# EAGLE schematic SensorNodeWithDisplay (EAGLE 9.6.2)
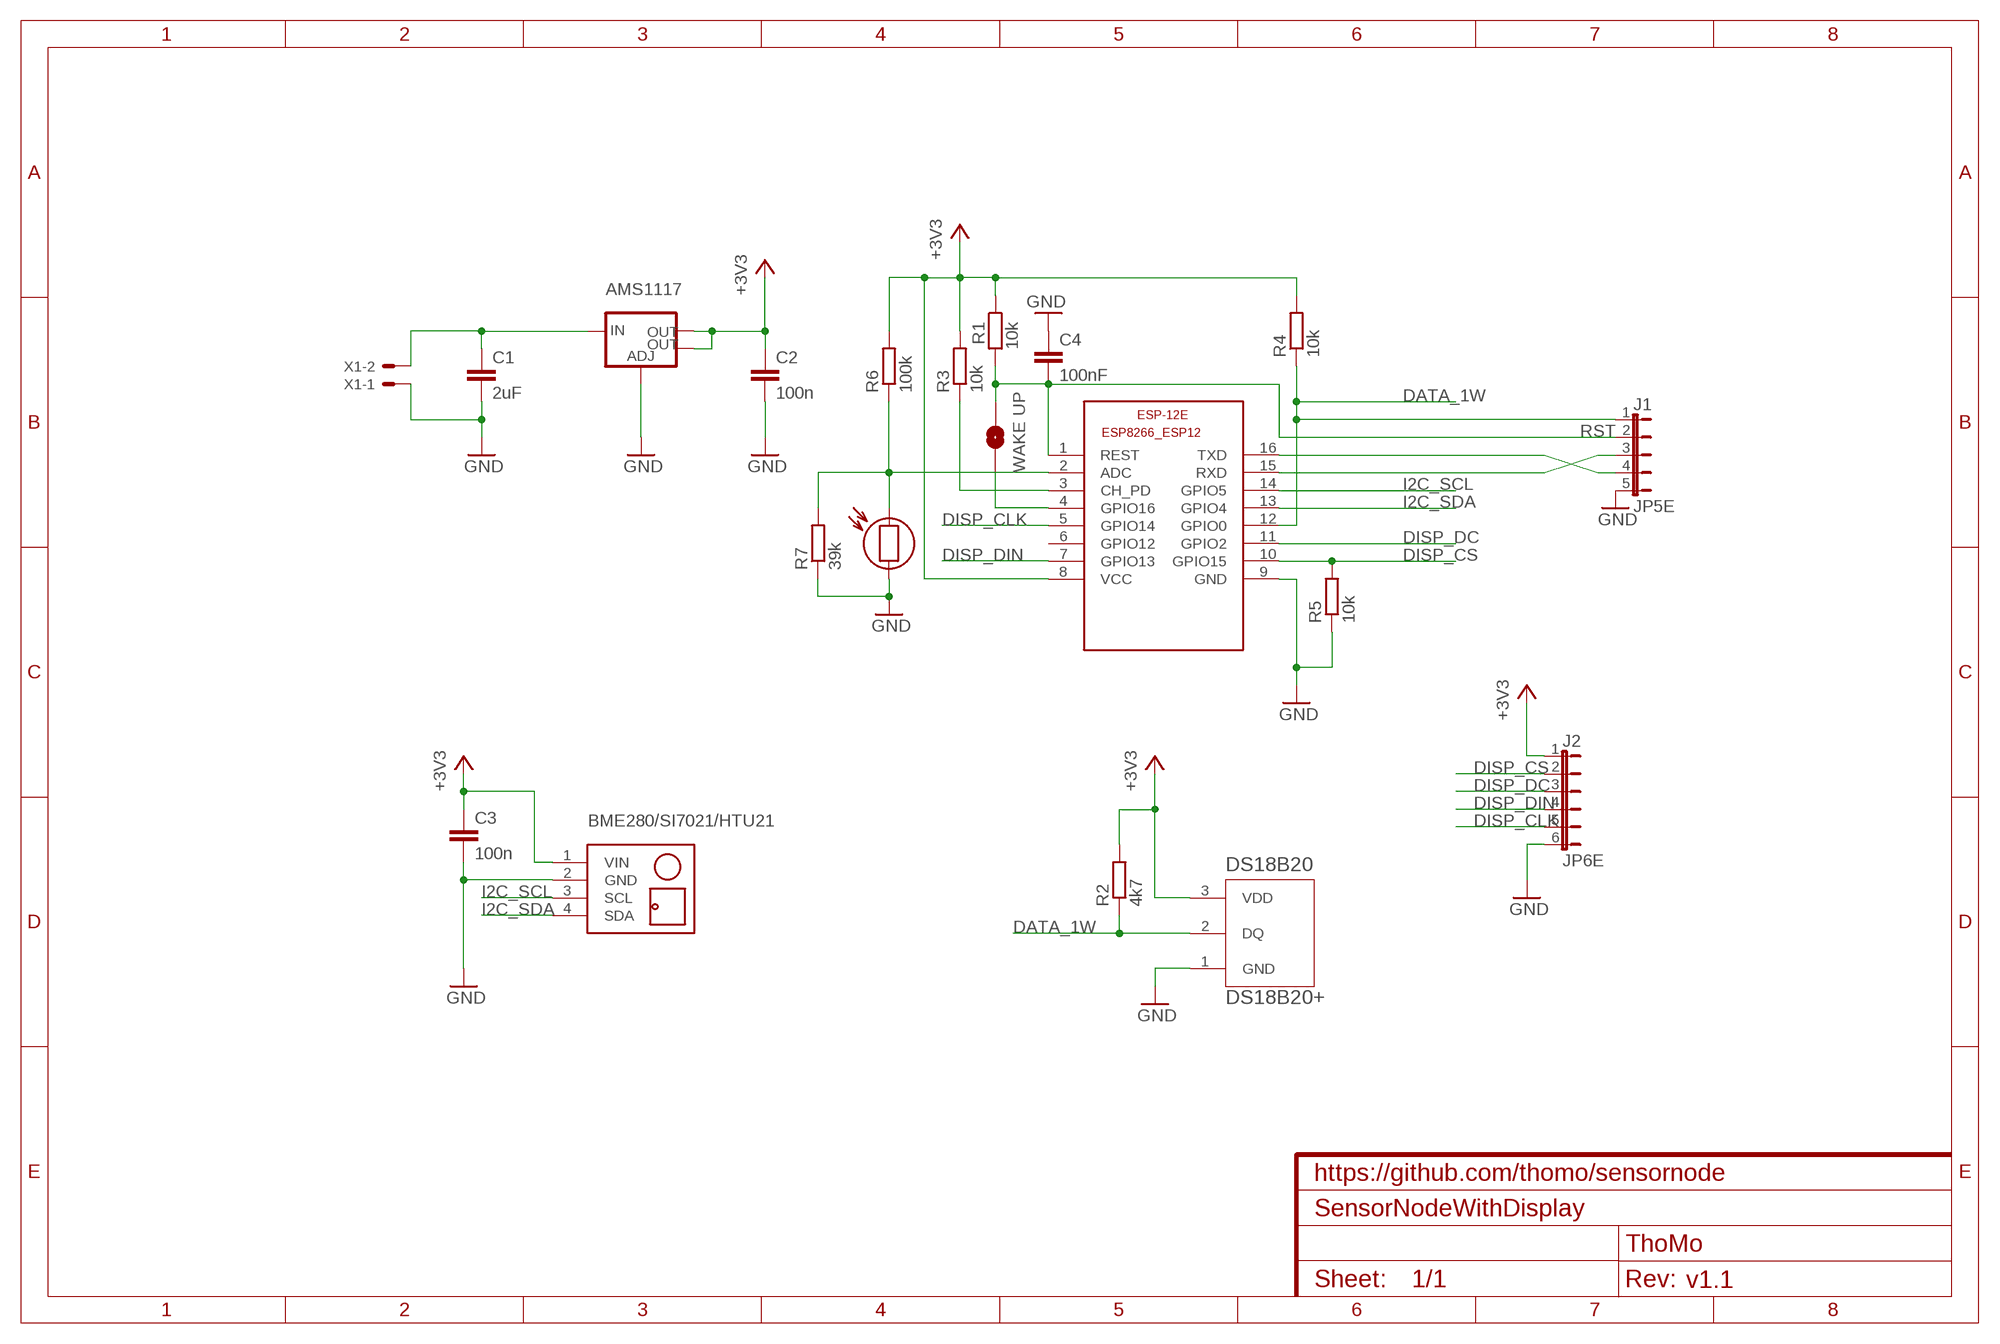
[diagram p0: schematic, sheet 1]
FRAME2 (FRAME-A4L): CNAME: https://github.com/thomo/sensornode; CREVISION: v1.1; DESIGNER: ThoMo

## Parts
AMS1117  V_REG_LM1117SOT223  [SOT223]
BME280/SI7021/HTU21  BME280  [BME280]
C1  2uF  C-EUC1206  [C1206]
C2  100n  C-EUC1206  [C1206]
C3  100n  C-EUC1206K  [C1206K]
C4  100nF  C-EUC1206  [C1206]
DS18B20  DS18B20+  [TO-92]
ESP-12E  ESP8266-12  [ESP8266-ESP12]
J1  JP5E  [JP5]
J2  JP6E  [JP6]
LDR  LDR-GL55XX  [GL55]
R1  10k  R-EU_M1206  [M1206]
R2  4k7  R-EU_M1206  [M1206]
R3  10k  R-EU_M1206  [M1206]
R4  10k  R-EU_M1206  [M1206]
R5  10k  R-EU_M1206  [M1206]
R6  100k  R-EU_M1206  [M1206]
R7  39k  R-EU_M1206  [M1206]
WAKEUP  WAKE UP  JUMPER-SMT_2_NO_SILK  [SMT-JUMPER_2_NO_SILK]
X1  JST-XH-02-PIN-LONG-PAD  [JST-XH-02-PACKAGE-LONG-PAD]

## Nets
+3V3: AMS1117.2(OUT) AMS1117.4(OUT) BME280/SI7021/HTU21.1(VIN) C2.1 C3.1 DS18B20.3(VDD) ESP-12E.8(VCC) J2.1 R1.1 R2.2 R3.2 R4.2 R6.2
DATA_1W: DS18B20.2(DQ) ESP-12E.12(GPIO0) J1.1 R2.1 R4.1
DISP_CLK: ESP-12E.5(GPIO14) J2.5
DISP_CS: ESP-12E.10(GPIO15) J2.2 R5.2
DISP_DC: ESP-12E.11(GPIO2) J2.3
DISP_DIN: ESP-12E.7(GPIO13) J2.4
GND: AMS1117.1(ADJ) BME280/SI7021/HTU21.2(GND) C1.2 C2.2 C3.2 C4.1 DS18B20.1(GND) ESP-12E.9(GND) J1.5 J2.6 LDR.2 R5.1 R7.1 X1.1
I2C_SCL: BME280/SI7021/HTU21.3(SCL) ESP-12E.14(GPIO5)
I2C_SDA: BME280/SI7021/HTU21.4(SDA) ESP-12E.13(GPIO4)
N$1: ESP-12E.15(RXD) J1.3
N$2: ESP-12E.4(GPIO16) WAKEUP.1
N$3: ESP-12E.3(CH_PD) R3.1
N$4: ESP-12E.16(TXD) J1.4
N$5: ESP-12E.2(ADC) LDR.1 R6.1 R7.2
N$8: AMS1117.3(IN) C1.1 X1.2
RST: C4.2 ESP-12E.1(REST) J1.2 R1.2 WAKEUP.2
Unconnected: ESP-12E.6(GPIO12)

## Library data of the parts
AMS1117 = SparkFun-IC-Power:V_REG_LM1117: Voltage Regulator LM1117 Standard adjustable voltage regulator but in SMD form. Spark Fun Electronics SKU : COM-00595; PROD_ID: VREG-08170
BME280/SI7021/HTU21 = thomo:BME280: Digital Humidity-Temperature-Pressure Sensor based on BME280 device More information about BME280 device is available here: https://www.bosch-sensortec.com/bst/products/all_products/bme280 Click here to find device on ebay.com <http://www.ebay.com/sch/bme280+breakout>
C1-C4 = rcl:C-EU: CAPACITOR, European symbol; SPICEPREFIX: C
DS18B20 = thomo:DS18B20+: 1wire Temp Sensor; MANUFACTURER_PART_NUMBER: DS18B20+; VENDOR: Maxim Integrated Products
ESP-12E = ESP8266-ESP12E:ESP8266-12: ESP8266-12
J1 = thomo:JP5E: 5pin connector
J2 = thomo:JP6E: 6pin connector
LDR = thomo:LDR-GL55XX: LDR GL55xx (size: 5.2x4.4 mm, pin dist: 3 mm)
R1-R7 = rcl:R-EU_: RESISTOR, European symbol; SPICEPREFIX: R
WAKEUP = SparkFun-Jumpers:JUMPER-SMT_2_NO: Normally open jumper This jumper has two pads in close proximity to each other. Apply solder to close the connection. Round pads are easier to solder for beginners, but are a lot larger. SparkFun Product that uses the round pads: SparkFun EL Sequencer <https://www.sparkfun.com/products/12781>
X1 = Rembrandt Electronics - JST XH Connectors v1-0:JST-XH-02-PIN: JST XH Connector 2 Pin Wire to board connector. Pitch: 2,54 mm, (0.100") Number of pins: 2 Created by Rembrandt Electronics www.rembrandtelectronics.com